# EAGLE schematic main_keyring (EAGLE 9.6.2)
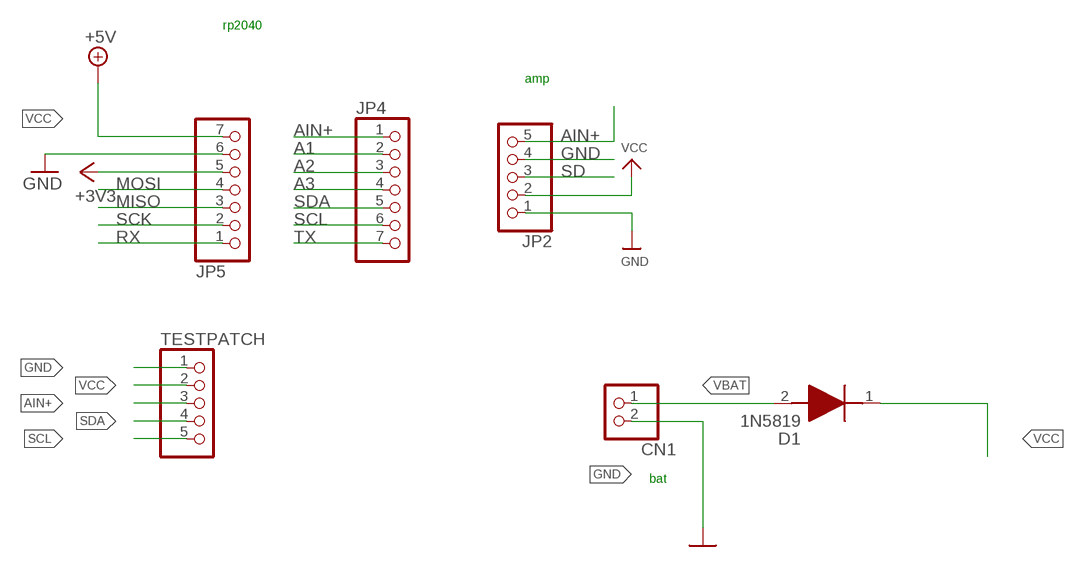
[diagram p0: schematic, sheet 1]

## Parts
CN1  JST_2PIN-THM  [JST-PH-2-THM]
D1  1N5819  [DIOAD1414W86L464D238]
JP2  HEADER-1X570MIL  [1X05_ROUND_70]
JP4  HEADER-1X7  [1X07_OVAL]
JP5  HEADER-1X7  [1X07_OVAL]
TESTPATCH  PINHD-1X5  [1X05]

## Nets
+3V3: JP5.5
A1: JP4.2
A2: JP4.3
A3: JP4.4
AIN+: JP2.5 JP4.1 TESTPATCH.3
GND: CN1.2 JP2.1 JP2.4 JP5.6 TESTPATCH.1
MISO: JP5.3
MOSI: JP5.4
RX: JP5.1
SCK: JP5.2
SCL: JP4.6 TESTPATCH.5
SD: JP2.3
SDA: JP4.5 TESTPATCH.4
TX: JP4.7
VBAT: CN1.1 D1.2(A)
VCC: D1.1(K) JP2.2 JP5.7 TESTPATCH.2 ; supply symbol labelled +5V

## Notes on the sheet
- rp2040
- amp
- bat

## Library data of the parts
CN1 = adafruit:JST_2PIN: JST 2-Pin Connectors of various flavors SMT-RA (S2B-PH-SM4) 4UConnector #17311 SMT (B2B-PH-SM4) THM-RA (S2B-PH) THM (B2B-PH)
D1 = SamacSys_Parts:1N5819: Schottky barrier diode,1N58191A 40V STMicroelectronics 1N5819, Schottky Diode, 40V 1A, 2-Pin DO-204AL Source: Datasheet <http://uk.rs-online.com/web/p/products/4864460P>; ALLIED_NUMBER: 70013816; DESCRIPTION: Schottky barrier diode,1N58191A 40V STMicroelectronics 1N5819, Schottky Diode, 40V 1A, 2-Pin DO-204AL; HEIGHT: mm; MANUFACTURER_NAME: STMicroelectronics; MANUFACTURER_PART_NUMBER: 1N5819; RS_PART_NUMBER: 4864460P; RS_PRICE-STOCK: http://uk.rs-online.com/web/p/products/4864460P
JP2 = microbuilder:HEADER-1X5: PIN HEADER
JP4 JP5 = microbuilder:HEADER-1X7: PIN HEADER
TESTPATCH = pinhead:PINHD-1X5: PIN HEADER

## Net classes
1 power: width 0.305 mm
2 lowpower: width 0.254 mm, drill 0.381 mm